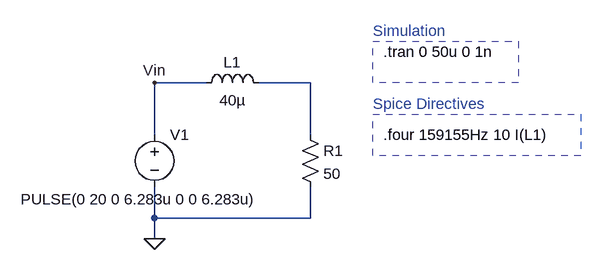
[diagram p0: schematic Main_Example.asc]
Main_Example.asc, the LTspice schematic file:
Version 4
SHEET 1 1900 680
WIRE 576 48 496 48
WIRE 736 48 656 48
WIRE 496 128 496 48
WIRE 736 128 736 48
WIRE 496 256 496 208
WIRE 736 256 736 208
WIRE 736 256 496 256
WIRE 496 288 496 256
FLAG 496 288 0
FLAG 496 48 Vin
SYMBOL voltage 496 112 R0
WINDOW 3 -206 115 Left 2
WINDOW 123 0 0 Left 0
WINDOW 39 0 0 Left 0
SYMATTR Value PULSE(0 20 0 6.283u 0 0 6.283u)
SYMATTR InstName V1
SYMBOL ind 560 64 R270
WINDOW 0 32 56 VTop 2
WINDOW 3 5 56 VBottom 2
SYMATTR InstName L1
SYMATTR Value 40µ
SYMBOL res 720 112 R0
SYMATTR InstName R1
SYMATTR Value 50
TEXT 848 128 Left 2 !.four 159155Hz 10 I(L1)
TEXT 848 0 Left 2 !.tran 0 50u 0 1n
TEXT 832 -32 Left 2 ;Simulation
TEXT 832 80 Left 2 ;Spice Directives
RECTANGLE Normal 1056 48 832 -16 2
RECTANGLE Normal 1152 160 832 96 2

The netlist it stands for:
* Main_Example.asc
V1 Vin 0 PULSE(0 20 0 6.283u 0 0 6.283u)
L1 Vin N001 40µ
R1 N001 0 50
.four 159155Hz 10 I(L1)
.tran 0 50u 0 1n
* Simulation
* Spice Directives
.backanno
.end